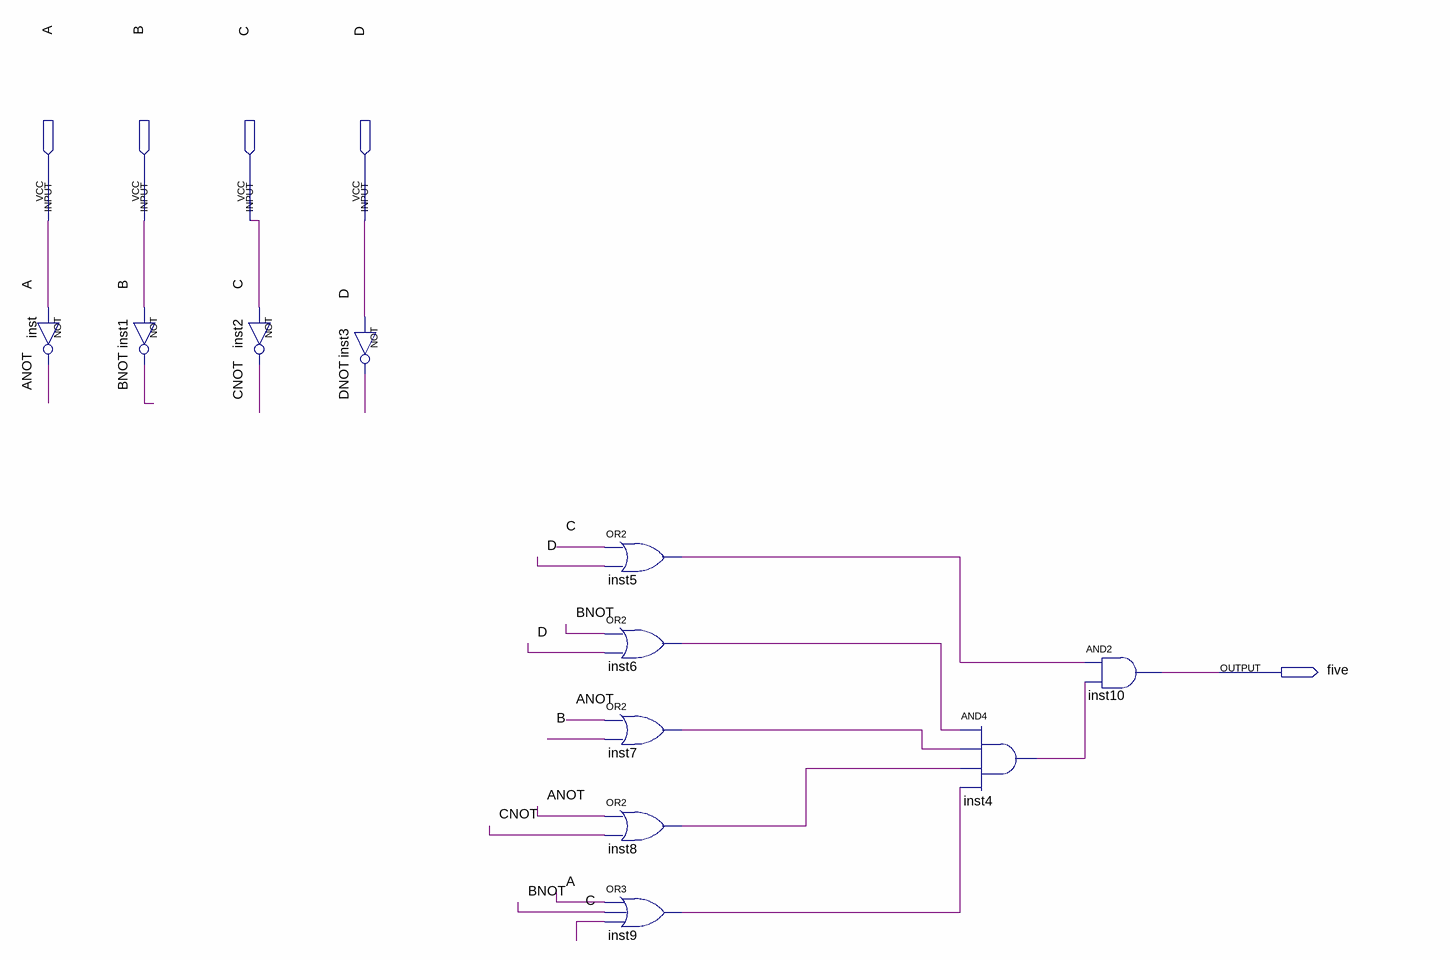
[diagram p0: schematic sheet]
// Quartus schematic output5.bdf as structural Verilog: 11 symbols, 5 pins
module output5 (
  input  A,
  input  B,
  input  C,
  input  D,
  output five
);

  wire ANOT, BNOT, CNOT, DNOT, inst4_out, inst5_out, inst6_out, inst7_out, inst8_out, inst9_out;

  not inst (ANOT, A);
  not inst1 (BNOT, B);
  not inst2 (CNOT, C);
  not inst3 (DNOT, D);
  or inst5 (inst5_out, C, D);
  or inst6 (inst6_out, BNOT, D);
  or inst7 (inst7_out, ANOT, B);
  or inst8 (inst8_out, ANOT, CNOT);
  or inst9 (inst9_out, A, BNOT, C);
  and inst4 (inst4_out, inst6_out, inst7_out, inst8_out, inst9_out);
  and inst10 (five, inst5_out, inst4_out);
endmodule
